# Altium schematic sheet Gate_Driver.SchDoc
size A4; SheetNumber: 4; SheetTotal: 6
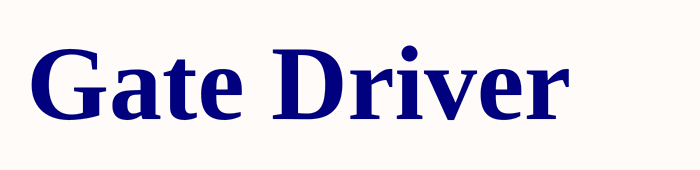
[diagram p0: Gate_Driver.SchDoc]

## Notes on the sheet
- Gate Driver